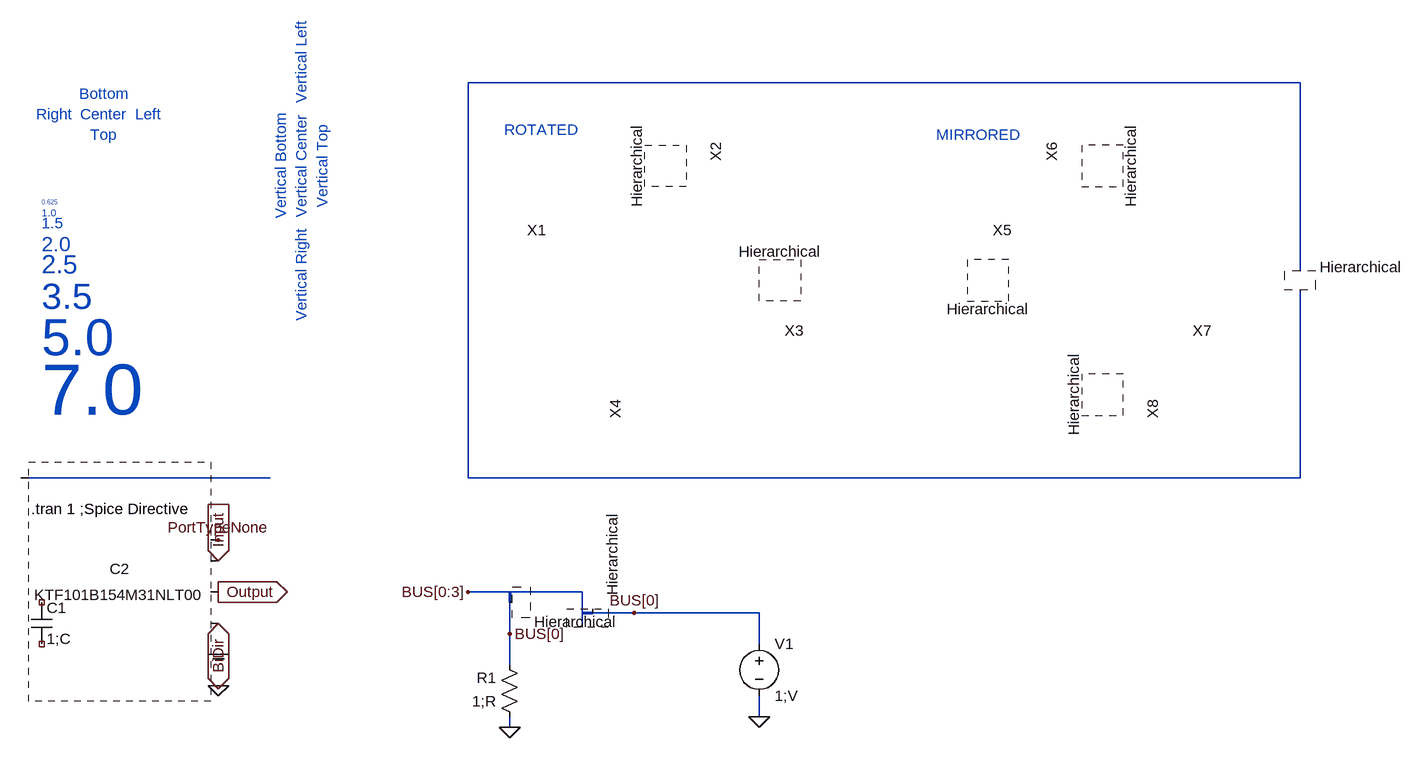
[diagram p0: schematic complex_sample.asc]
complex_sample.asc, the LTspice schematic file:
Version 4.1
SHEET 1 2336 2048
WIRE 1024 592 720 592
WIRE 1696 592 1024 592
WIRE 2000 592 1696 592
WIRE 2000 880 2000 592
WIRE 720 896 720 592
WIRE 416 1200 32 1200
WIRE 720 1200 720 896
WIRE 1024 1200 720 1200
WIRE 1696 1200 1024 1200
WIRE 2000 1200 2000 912
WIRE 2000 1200 1696 1200
WIRE 784 1376 720 1376
WIRE 896 1376 784 1376
WIRE 896 1408 896 1376
WIRE 976 1408 912 1408
WIRE 1168 1408 976 1408
WIRE 896 1424 896 1408
WIRE 784 1440 784 1392
WIRE 1168 1456 1168 1408
WIRE 784 1488 784 1440
WIRE 1168 1568 1168 1536
WIRE 784 1584 784 1568
FLAG 336 1520 0
FLAG 336 1296 PortTypeNone
FLAG 336 1328 Input
IOPIN 336 1328 In
FLAG 336 1376 Output
IOPIN 336 1376 Out
FLAG 336 1424 BiDir
IOPIN 336 1424 BiDir
FLAG 336 1472 COM
FLAG 720 1376 BUS[0:3]
FLAG 1168 1568 0
FLAG 976 1408 BUS[0]
FLAG 784 1440 BUS[0]
FLAG 784 1584 0
DATAFLAG 1072 1408 "$/I(R1)"
BUSTAP 896 1408 912 1408
BUSTAP 784 1376 784 1392
SYMBOL Hierarchical 848 896 R0
WINDOW 0 -22 -62 Bottom 2
WINDOW 39 -74 120 Left 1
SYMATTR InstName X1
SYMBOL voltage 1168 1440 R0
SYMATTR InstName V1
SYMATTR Value 1;V
SYMBOL res 800 1584 R180
WINDOW 0 36 76 Left 2
WINDOW 3 36 40 Left 2
SYMATTR InstName R1
SYMATTR Value 1;R
SYMBOL cap 48 1392 R0
SYMATTR InstName C1
SYMATTR Value 1;C
SYMBOL Hierarchical 1024 720 R90
WINDOW 0 -22 -62 Bottom 2
WINDOW 39 -74 120 Left 1
SYMATTR InstName X2
SYMBOL Hierarchical 1200 896 R180
WINDOW 0 -22 -62 Bottom 2
WINDOW 39 -74 120 Left 1
SYMATTR InstName X3
SYMBOL Hierarchical 1024 1072 R270
WINDOW 0 -22 -62 Bottom 2
WINDOW 39 -74 120 Left 1
SYMATTR InstName X4
SYMBOL Hierarchical 1520 896 M0
WINDOW 0 -22 -62 Bottom 2
WINDOW 39 -74 120 Left 1
SYMATTR InstName X5
SYMBOL Hierarchical 1696 720 M90
WINDOW 0 -22 -62 Bottom 2
WINDOW 39 -74 120 Left 1
SYMATTR InstName X6
SYMBOL Hierarchical 1872 896 M180
WINDOW 0 -22 -62 Bottom 2
WINDOW 39 -74 120 Left 1
SYMATTR InstName X7
SYMBOL Hierarchical 1696 1072 M270
WINDOW 0 -22 -62 Bottom 2
WINDOW 39 -74 120 Left 1
SYMATTR InstName X8
SYMBOL Contrib\\CHEMI-CON\\Capacitors\\CeramicCap-SMD\\KTF101B154M31NLT00 48 1536 R0
SYMATTR InstName C2
TEXT 208 640 Left 2 ;Left
TEXT 112 640 Right 2 ;Right
TEXT 160 640 Center 2 ;Center
TEXT 160 656 Top 2 ;Top
TEXT 160 624 Bottom 2 ;Bottom
TEXT 56 1512 Invisible 2 ;Not Visible
TEXT 64 776 Left 0 ;0.625
TEXT 64 792 Left 1 ;1.0
TEXT 64 808 Left 2 ;1.5
TEXT 64 840 Left 3 ;2.0
TEXT 64 872 Left 4 ;2.5
TEXT 64 920 Left 5 ;3.5
TEXT 64 984 Left 6 ;5.0
TEXT 64 1064 Left 7 ;7.0
TEXT 464 624 VLeft 2 ;Vertical Left
TEXT 464 816 VRight 2 ;Vertical Right
TEXT 464 720 VCenter 2 ;Vertical Center
TEXT 480 720 VTop 2 ;Vertical Top
TEXT 448 720 VBottom 2 ;Vertical Bottom
TEXT 48 1248 Left 2 !.tran 1 ;Spice Directive
TEXT 776 664 Left 2 ;ROTATED
TEXT 1440 672 Left 2 ;MIRRORED

The netlist it stands for:
* complex_sample.asc
* X1: Hierarchical (symbol Hierarchical not available, pin order unknown); nets seen at it: BUS[0]
V1 BUS[0] 0 1;V
R1 0 BUS[0] 1;R
C1 NC_01 NC_02 1;C
* X2: Hierarchical (symbol Hierarchical not available, pin order unknown); nets seen at it: 
* X3: Hierarchical (symbol Hierarchical not available, pin order unknown); nets seen at it: 
* X4: Hierarchical (symbol Hierarchical not available, pin order unknown); nets seen at it: BUS[0:3], BUS[0]
* X5: Hierarchical (symbol Hierarchical not available, pin order unknown); nets seen at it: 
* X6: Hierarchical (symbol Hierarchical not available, pin order unknown); nets seen at it: 
* X7: Hierarchical (symbol Hierarchical not available, pin order unknown); nets seen at it: N001
* X8: Hierarchical (symbol Hierarchical not available, pin order unknown); nets seen at it: 
* C2: KTF101B154M31NLT00 (symbol Contrib\CHEMI-CON\Capacitors\CeramicCap-SMD\KTF101B154M31NLT00 not available, pin order unknown); nets seen at it: 0, BiDir, COM, Input, N002, Output, PortTypeNone
* Left
* Right
* Center
* Top
* Bottom
* Not Visible
* 0.625
* 1.0
* 1.5
* 2.0
* 2.5
* 3.5
* 5.0
* 7.0
* Vertical Left
* Vertical Right
* Vertical Center
* Vertical Top
* Vertical Bottom
.tran 1 ;Spice Directive
* ROTATED
* MIRRORED
.backanno
.end